# Altium schematic sheet GSM IoT SIM.SchDoc: GSM IoT SIM
size A4
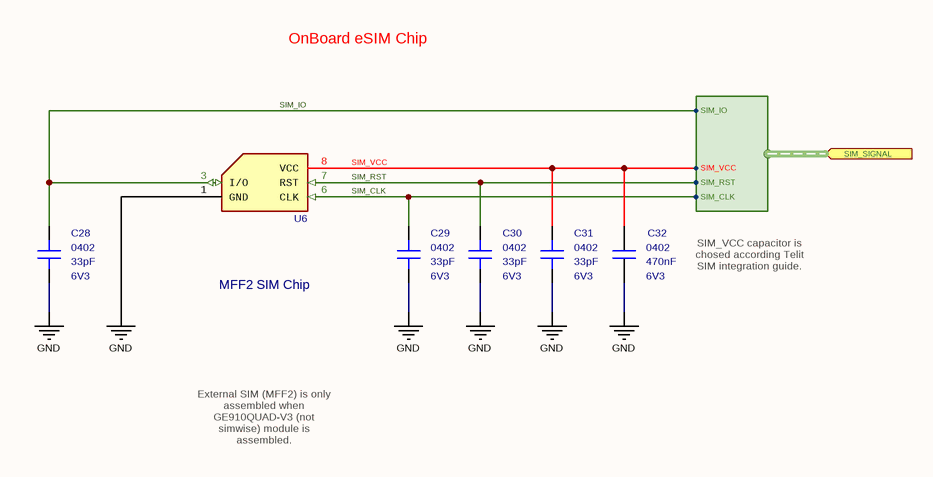
[diagram p0: GSM IoT SIM.SchDoc]

## Parts
C28  value 33pF  Case: 0402  Voltage: 6V3  [CAPACITOR_0402]  (hidden comment: Multilayer Ceramic Capacitor)
C29  value 33pF  Case: 0402  Voltage: 6V3  [CAPACITOR_0402]  (hidden comment: Multilayer Ceramic Capacitor)
C30  value 33pF  Case: 0402  Voltage: 6V3  [CAPACITOR_0402]  (hidden comment: Multilayer Ceramic Capacitor)
C31  value 33pF  Case: 0402  Voltage: 6V3  [CAPACITOR_0402]  (hidden comment: Multilayer Ceramic Capacitor)
C32  value 470nF  Case: 0402  Voltage: 6V3  [CAPACITOR_0402]  (hidden comment: Multilayer Ceramic Capacitors)
U6  MFF2 SIM Chip  [MFF2]

## Ports
SIM_SIGNAL (in, harness SIM_SIGNAL)

## Harnesses
SIM_SIGNAL: SIM_VCC, SIM_IO, SIM_RST, SIM_CLK

## Nets
GND: C28.1 C29.1 C30.1 C31.1 C32.1 U6.1(GND)
SIM_CLK: C29.2 U6.6(CLK) ; port SIM_SIGNAL.SIM_CLK
SIM_IO: C28.2 U6.3(I/O) ; port SIM_SIGNAL.SIM_IO
SIM_RST: C30.2 U6.7(RST) ; port SIM_SIGNAL.SIM_RST
SIM_VCC: C31.2 C32.2 U6.8(VCC) ; port SIM_SIGNAL.SIM_VCC

Not connected (* = marked no-connect by the designer): U6 2(NC) 4(NC) 5(NC)

## Notes on the sheet
- OnBoard eSIM Chip
- SIM_VCC capacitor is chosed according Telit SIM integration guide.
- External SIM (MFF2) is only assembled when GE910QUAD-V3 (not simwise) module is assembled.
- Title
- Size:
- Date:
- A4
- Number:
- Time:
- Revision:
- Sheet
- of
- File:

## Library data of the parts
C28-C31 = Capacitor - 33pF [0402-6V3]: Capacitor - 33pF [0402] (Ceramic); Manufacturer_Name: Kemet; Manufacturer_Part_Number: C0402C330J9RACAUTO; Dielectric: X7R; Tolerance: 10%; Height: 0.5mm; Mouser_Part_Number: 80-C0402C330J9RAUTO; Maximum Operating Temperature: +125; Minimum Operating Temperature: -55; ROHS: Yes; ComponentLink1Description: DataSheet; ComponentLink1URL: https://api.kemet.com/component-edge/download/datasheet/C0402C330J9RACAUTO.pdf; ComponentLink2Description: Mouser; ComponentLink2URL: https://www.mouser.com/Search/Refine.aspx?Keyword=80-C0402C330J9RAUTO; Supplier 1: Mouser; Supplier Part Number 1: 80-C0402C330J9RAUTO
C32 = Capacitor - 470nF [0402-6V3]: Capacitor - 470nF [0402] (Ceramic); Manufacturer_Name: AVX; Manufacturer_Part_Number: 04026C474KAT2A; Dielectric: X7R; Tolerance: %10; Height: 0.4mm; Mouser_Part_Number: 581-04026C474KAT2A; ComponentLink1Description: Mouser; ComponentLink1URL: https://www.mouser.com.tr/ProductDetail/AVX/04026D104KAT4A?qs=sGAEpiMZZMs0AnBnWHyRQPg4iYkCw7IMED%2F4kpqgf7w%3D; ComponentLink2Description: DataSheet; ComponentLink2URL: https://www.mouser.com.tr/datasheet/2/40/cx5r-776519.pdf; ROHS: Yes; Maximum Operating Temperature: +125; Minimum Operating Temperature: -55; Supplier 1: Mouser; Supplier Part Number 1: 581-04026C474KAT2A
U6 = IC - MFF2: SIM Chip MFF2